# EAGLE design RGBTemp (EAGLE 8.6.3)
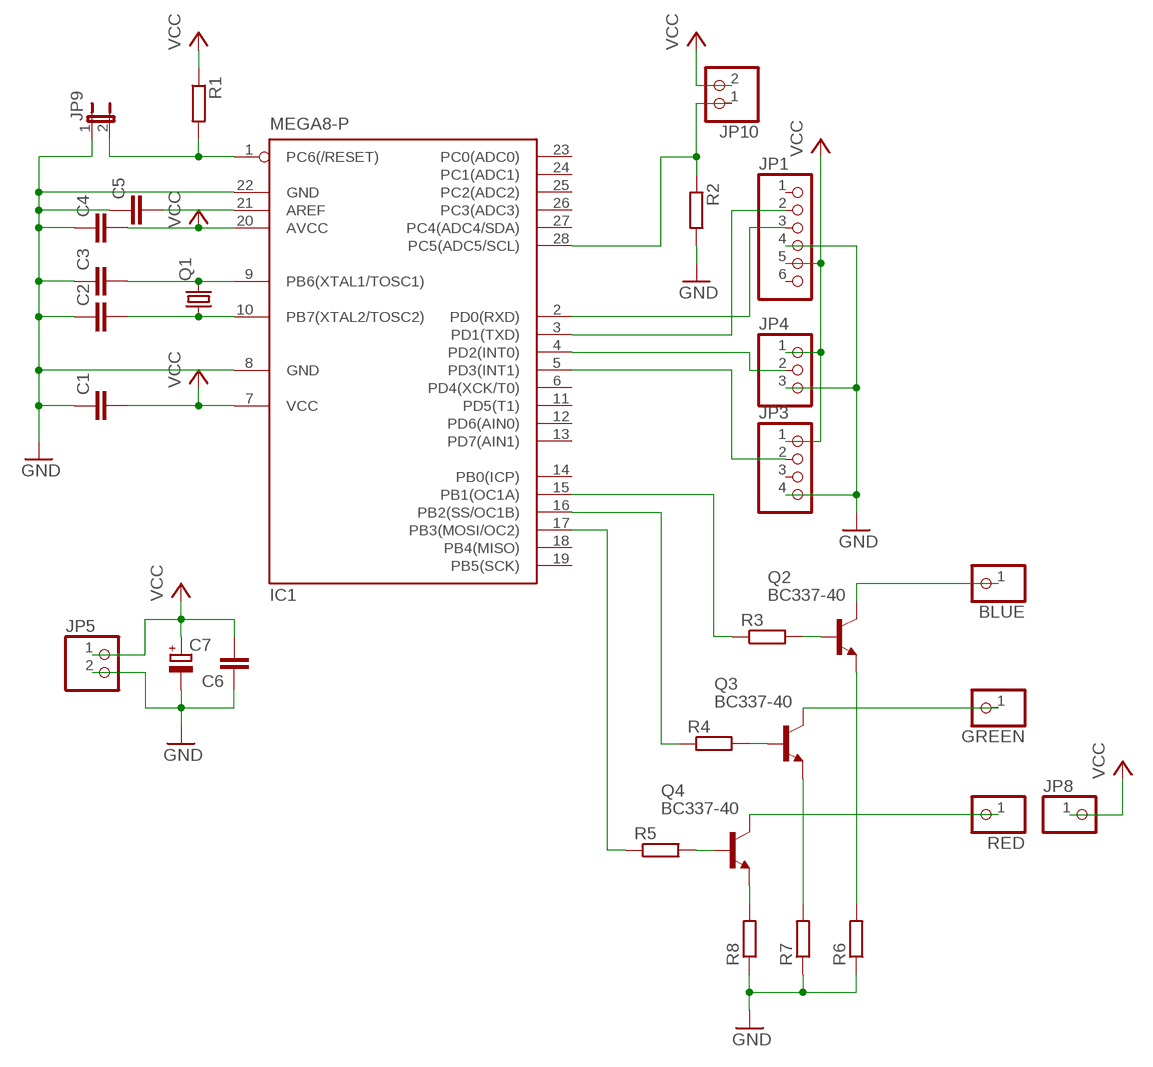
[diagram p0: schematic, sheet 1]

## Parts
BLUE  PINHD-1X1  [1X01]
C1  C-EU025-025X050  [C025-025X050]
C2  C-EU025-025X050  [C025-025X050]
C3  C-EU025-025X050  [C025-025X050]
C4  C-EU025-025X050  [C025-025X050]
C5  C-EU025-025X050  [C025-025X050]
C6  C-EU025-025X050  [C025-025X050]
C7  CPOL-EUE5-8.5  [E5-8,5]
GREEN  PINHD-1X1  [1X01]
IC1  MEGA8-P  [DIL28-3]
JP1  PINHD-1X6  [1X06]
JP3  PINHD-1X4  [1X04]
JP4  PINHD-1X3  [1X03]
JP5  PINHD-1X2  [1X02]
JP8  PINHD-1X1  [1X01]
JP9  JP1E  [JP1]
JP10  PINHD-1X2  [1X02]
Q1  CRYSTALHC49U-V  [HC49U-V]
Q2  BC337-40  [TO92]
Q3  BC337-40  [TO92]
Q4  BC337-40  [TO92]
R1  R-EU_R1206  [R1206]
R2  R-EU_R1206  [R1206]
R3  R-EU_R1206  [R1206]
R4  R-EU_R1206  [R1206]
R5  R-EU_R1206  [R1206]
R6  R-EU_0207/2V  [0207/2V]
R7  R-EU_0207/2V  [0207/2V]
R8  R-EU_0207/2V  [0207/2V]
RED  PINHD-1X1  [1X01]

## Nets
GND: C1.1 C2.1 C3.1 C4.1 C5.1 C6.1 C7.- IC1.8(GND) IC1.22(GND) JP1.4 JP3.4 JP4.3 JP5.2 JP9.1 R2.2 R6.1 R7.1 R8.1
N$1: C2.2 IC1.10(PB7(XTAL2/TOSC2)) Q1.1
N$2: C3.2 IC1.9(PB6(XTAL1/TOSC1)) Q1.2
N$3: IC1.1(PC6(/RESET)) JP9.2 R1.2
N$4: C5.2 IC1.21(AREF)
N$6: Q4.3(C) RED.1
N$8: IC1.4(PD2(INT0)) JP4.2
N$9: IC1.5(PD3(INT1)) JP3.2
N$10: IC1.2(PD0(RXD)) JP1.3
N$11: IC1.3(PD1(TXD)) JP1.2
N$12: Q4.2(B) R5.2
N$13: Q3.2(B) R4.2
N$14: Q2.2(B) R3.2
N$15: Q2.1(E) R6.2
N$16: Q3.1(E) R7.2
N$17: Q4.1(E) R8.2
N$18: IC1.15(PB1(OC1A)) R3.1
N$19: IC1.16(PB2(SS/OC1B)) R4.1
N$20: IC1.17(PB3(MOSI/OC2)) R5.1
N$21: GREEN.1 Q3.3(C)
N$22: BLUE.1 Q2.3(C)
N$23: IC1.28(PC5(ADC5/SCL)) JP10.1 R2.1
VCC: C1.2 C4.2 C6.2 C7.+ IC1.7(VCC) IC1.20(AVCC) JP1.5 JP3.1 JP4.1 JP5.1 JP8.1 JP10.2 R1.1
Unconnected: IC1.6(PD4(XCK/T0)) IC1.11(PD5(T1)) IC1.12(PD6(AIN0)) IC1.13(PD7(AIN1)) IC1.14(PB0(ICP)) IC1.18(PB4(MISO)) IC1.19(PB5(SCK)) IC1.23(PC0(ADC0)) IC1.24(PC1(ADC1)) IC1.25(PC2(ADC2)) IC1.26(PC3(ADC3)) IC1.27(PC4(ADC4/SDA)) JP1.1 JP1.6 JP3.3

## Library data of the parts
BLUE GREEN JP8 RED = pinhead:PINHD-1X1: PIN HEADER
C1-C6 = rcl:C-EU: CAPACITOR, European symbol; SPICEPREFIX: C
C7 = rcl:CPOL-EU: POLARIZED CAPACITOR, European symbol; SPICEPREFIX: C
IC1 = atmel:MEGA8-P: MICROCONTROLLER 8 Kbytes FLASH, 1 kbytes SRAM, 512 bytes EEPROM, USART, 4-channel 10 bit ADC, 2-channel 8 bit ADC Pin compatible with Atmega48, ATMega88, ATMega168 Source: avr.lbr; OC_FARNELL: unknown; OC_NEWARK: unknown
JP1 = pinhead:PINHD-1X6: PIN HEADER
JP3 = pinhead:PINHD-1X4: PIN HEADER
JP4 = pinhead:PINHD-1X3: PIN HEADER
JP5 JP10 = pinhead:PINHD-1X2: PIN HEADER
JP9 = jumper:JP1E: JUMPER
Q1 = crystal:CRYSTAL: CRYSTAL; OC_FARNELL: 1666969; OC_NEWARK: unknown
Q2-Q4 = transistor-npn:BC337*: NPN Transistor
R1-R8 = rcl:R-EU_: RESISTOR, European symbol; SPICEPREFIX: R

## Board
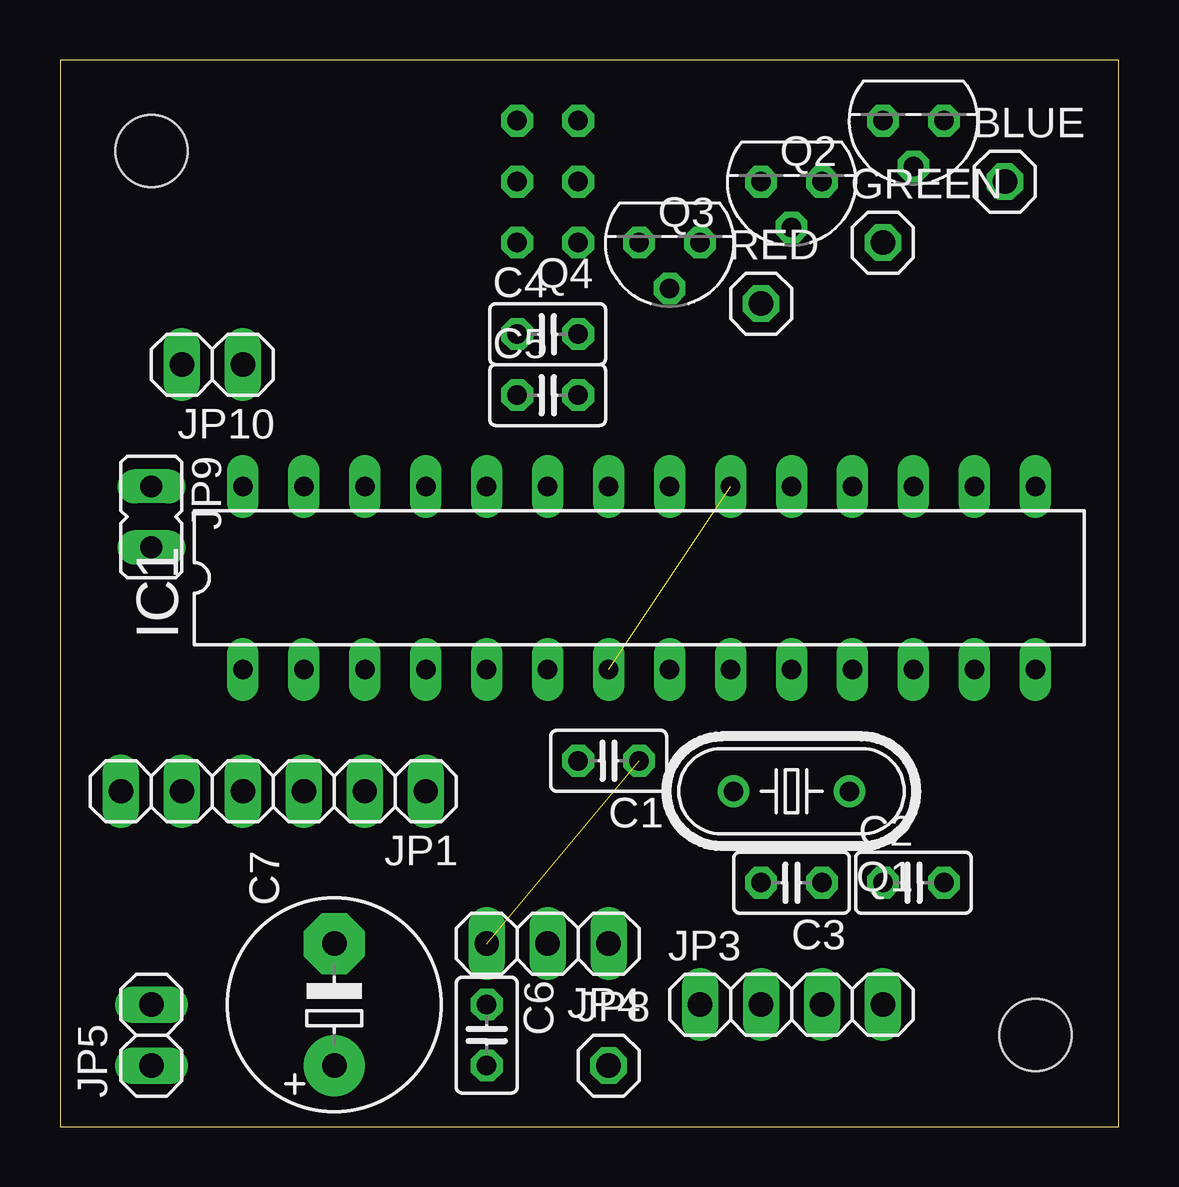
[diagram p1: board, top side]
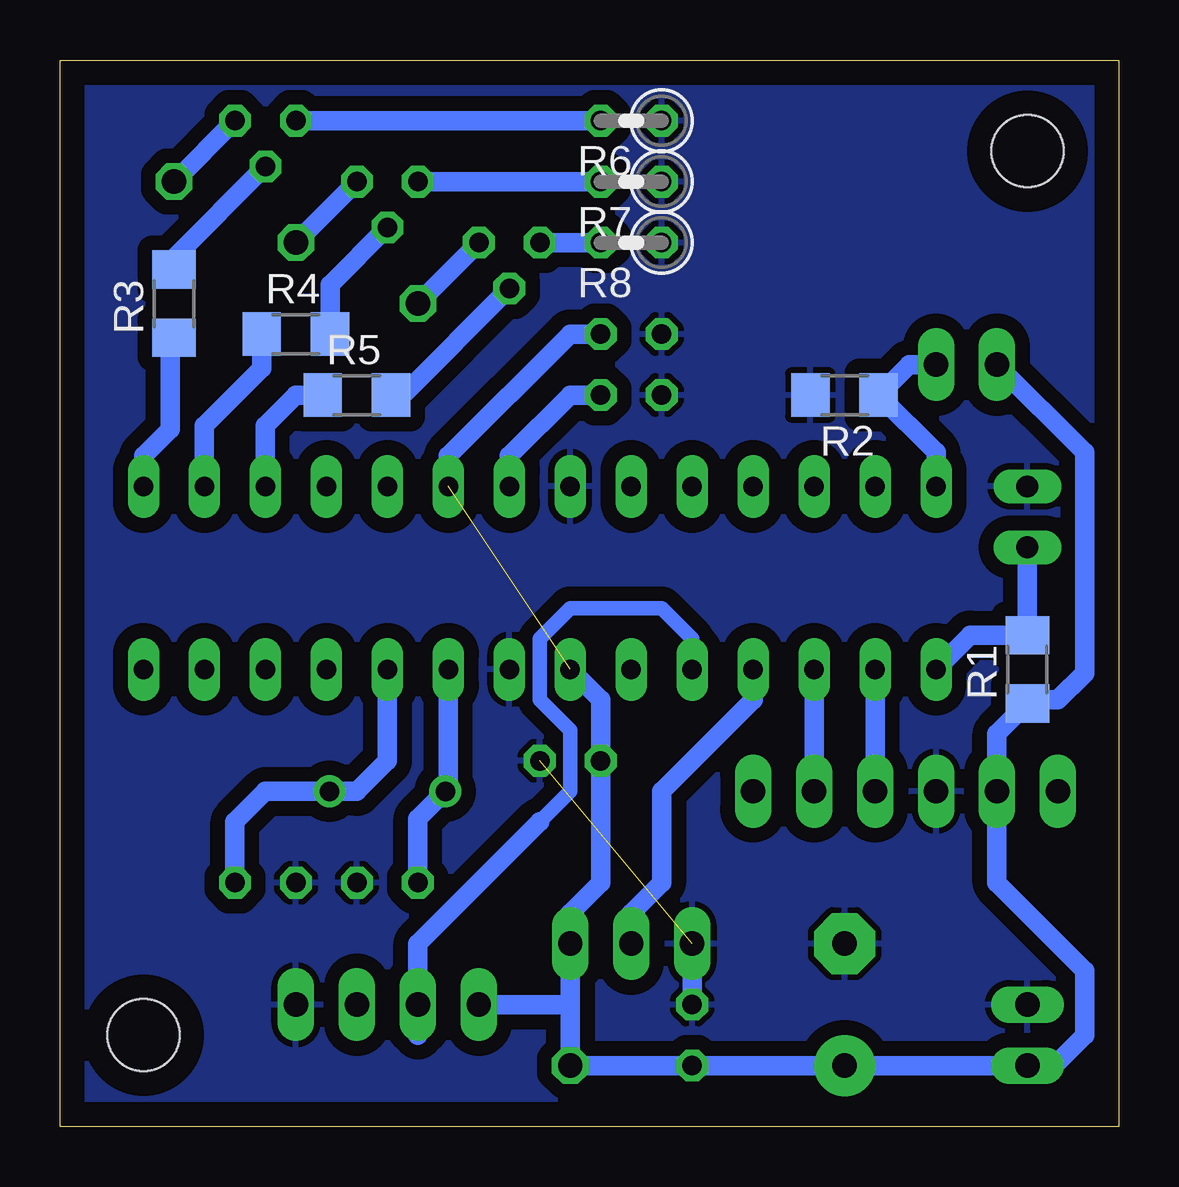
[diagram p2: board, bottom side, seen from below]

Size 44.12 x 44.44 mm. Coordinates in mm from the lower left corner, seen from the top.
Outline: 0,0 44.12,0 44.12,44.44 0,44.44 0,0
Copper layers (1*16): Top 0.035mm / dielectric 1.5mm / Bottom 0.035mm
Design rules "RGBTemp *": minimum track width 6mil, minimum drill 0.35mm, track to track 24mil, track to pad 24mil, pad to pad 0.205mm, via to via 0.205mm, smd to smd 6mil, copper to edge 40mil, drill to drill 6mil, minimum pad ring 10mil, minimum via ring 8mil, stop-mask expansion 4mil, vias tented up to drill 0mil, thermal gap 10mil
Holes 3 mm at 40.64,3.81 3.81,40.64

### Footprints (pad centres in the part's own frame; a part is rotated, then mirrored left to right if it is on the bottom)
1X01 = drill 1.016 octagon: 1 0,0
C025-025X050 = drill 0.813 octagon: 1 -1.27,0; 2 1.27,0
E5-8,5 = drill 1.016 pad 2.54: + -2.54,0 | drill 1.016 pad 2.54 octagon: - 2.54,0
DIL28-3 = drill 0.813 long: 1 -16.51,-3.81; 2 -13.97,-3.81; 3 -11.43,-3.81; 4 -8.89,-3.81; 5 -6.35,-3.81; 6 -3.81,-3.81; 7 -1.27,-3.81; 8 1.27,-3.81; 9 3.81,-3.81; 10 6.35,-3.81; 11 8.89,-3.81; 12 11.43,-3.81; 13 13.97,-3.81; 14 16.51,-3.81; 15 16.51,3.81; 16 13.97,3.81; 17 11.43,3.81; 18 8.89,3.81; 19 6.35,3.81; 20 3.81,3.81; 21 1.27,3.81; 22 -1.27,3.81; 23 -3.81,3.81; 24 -6.35,3.81; 25 -8.89,3.81; 26 -11.43,3.81; 27 -13.97,3.81; 28 -16.51,3.81
1X06 = drill 1.016 long: 1 -6.35,0; 2 -3.81,0; 3 -1.27,0; 4 1.27,0; 5 3.81,0; 6 6.35,0
1X04 = drill 1.016 long: 1 -3.81,0; 2 -1.27,0; 3 1.27,0; 4 3.81,0
1X03 = drill 1.016 long: 1 -2.54,0; 2 0,0; 3 2.54,0
1X02 = drill 1.016 long: 1 -1.27,0; 2 1.27,0
JP1 = drill 0.914 long: 1 0,-1.27; 2 0,1.27
HC49U-V = drill 0.813: 1 -2.413,0; 2 2.413,0
TO92 = drill 0.813 octagon: 1 1.27,0; 2 0,1.905; 3 -1.27,0
R1206 = smd 1.6 x 1.803: 1 -1.422,0; 2 1.422,0
0207/2V = drill 0.813 octagon: 1 -1.27,0; 2 1.27,0

### Placement (x,y rotation side)
BLUE  39.37,39.37 0 top
C1  22.86,15.24 180 top
C2  35.56,10.16 0 top
C3  30.48,10.16 180 top
C4  20.32,33.02 0 top
C5  20.32,30.48 0 top
C6  17.78,3.81 270 top
C7  11.43,5.08 90 top
GREEN  34.29,36.83 0 top
IC1  24.13,22.86 0 top
JP1  8.89,13.97 180 top
JP3  30.48,5.08 0 top
JP4  20.32,7.62 180 top
JP5  3.81,3.81 90 top
JP8  22.86,2.54 0 top
JP9  3.81,25.4 180 top
JP10  6.35,31.75 180 top
Q1  30.48,13.97 180 top
Q2  35.56,41.91 180 top
Q3  30.48,39.37 180 top
Q4  25.4,36.83 180 top
R1  3.81,19.05 90 bottom
R2  11.43,30.48 180 bottom
R3  39.37,34.29 90 bottom
R4  34.29,33.02 0 bottom
R5  31.75,30.48 0 bottom
R6  20.32,41.91 180 bottom
R7  20.32,39.37 180 bottom
R8  20.32,36.83 180 bottom
RED  29.21,34.29 0 top

### Tracks (layer width: path | path; a pad name or v marks a point on that pad's centre or on a via)
GND  (1 unrouted)
  Bottom 0.813: C6.1 JP4.3
  pour Bottom: 0,44.45 44.45,44.45 44.45,0 0,0
N$1
  Bottom 0.813: IC1.10 30.48,15.24 31.75,13.97 Q1.1 35.56,13.97 36.83,12.7 C2.2
N$2
  Bottom 0.813: IC1.9 27.94,14.1 Q1.2 29.21,12.83 C3.2
N$3
  Bottom 0.813: IC1.1 6.2,20.47 R1.2 JP9.2
N$4
  Bottom 0.813: IC1.21 25.4,27.94 22.86,30.48 C5.2
N$6
  Bottom 0.813: Q4.3 RED.1
N$8
  Bottom 0.813: JP4.2 20.32,8.89 19.05,10.16 19.05,13.97 15.24,17.78 IC1.4
N$9
  Bottom 0.61: IC1.5 17.78,20.32 19.05,21.59 22.86,21.59 24.13,20.32 24.13,17.78 22.86,16.51 22.86,13.97 24.13,12.7
  Bottom 0.813: 29.21,3.81 JP3.2 29.21,7.62 24.13,12.7
N$10
  Bottom 0.813: JP1.3 IC1.2
N$11
  Bottom 0.813: IC1.3 JP1.2
N$12
  Bottom 0.813: Q4.2 29.84,30.48 R5.2
N$13
  Bottom 0.813: Q3.2 32.87,35.08 R4.2
N$14
  Bottom 0.813: Q2.2 39.37,36.2 R3.2
N$15
  Bottom 0.813: R6.2 Q2.1
N$16
  Bottom 0.813: R7.2 Q3.1
N$17
  Bottom 0.813: R8.2 Q4.1
N$18
  Bottom 0.813: IC1.15 40.64,27.94 39.52,29.06 39.52,32.72 arc90 R3.1
N$19
  Bottom 0.813: IC1.16 38.1,29.21 35.71,31.6 R4.1
N$20
  Bottom 0.813: IC1.17 35.56,29.21 34.29,30.48 R5.1
N$21
  Bottom 0.813: Q3.3 GREEN.1
N$22
  Bottom 0.813: Q2.3 BLUE.1
N$23
  Bottom 0.813: IC1.28 7.62,28.09 R2.1 8.74,31.75 JP10.1
VCC  (1 unrouted)
  Bottom 0.813: IC1.7 21.59,17.78 C1.2 21.59,10.16 22.86,8.89 JP4.1 22.86,5.08 | 22.86,5.08 JP8.1 C6.2 C7.+ JP5.1 2.69,2.54 1.42,3.81 1.42,6.5 5.08,10.16 JP1.5 5.08,16.36 R1.1 3.81,17.78 2.54,17.78 1.42,18.9 1.42,28.09 JP10.2 | JP3.1 22.86,5.08 | C4.2 22.86,33.02 27.94,27.94 IC1.20